# Altium project PCB_Project.PrjPcb
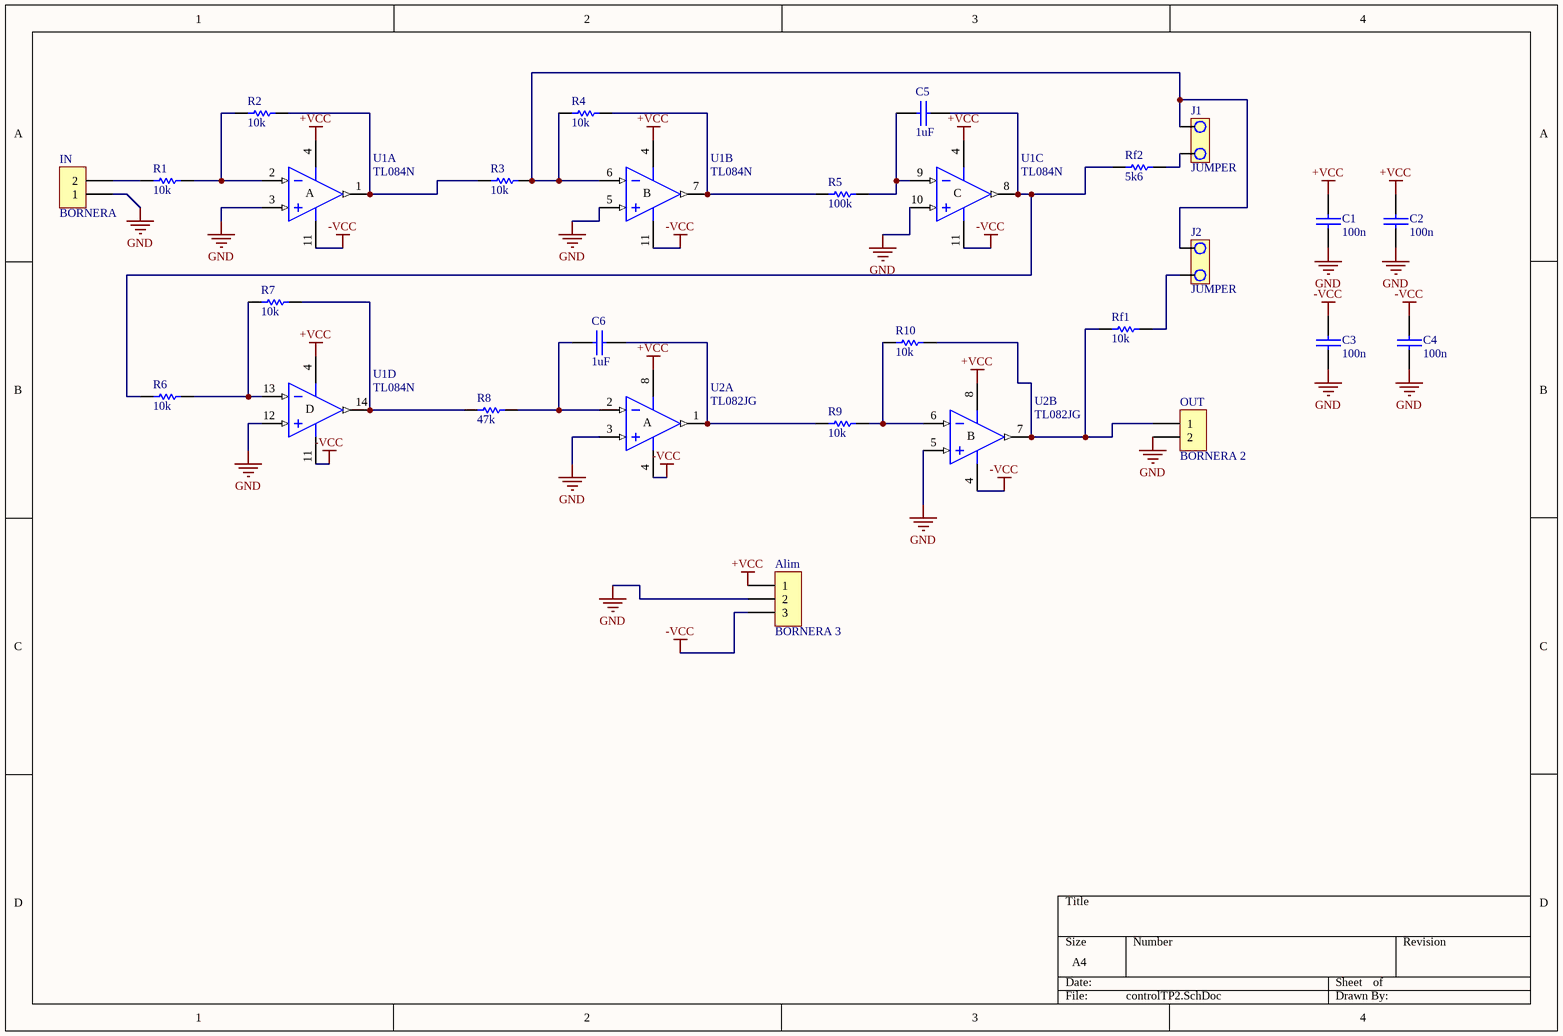
[diagram p0: controlTP2.SchDoc]
1 sheet, 25 parts. Net scope: global (net labels, ports and power ports of the same name join across sheets).
Board file: controlTP2.PcbDoc

## Sheet controlTP2.SchDoc
size A4

### Parts
Alim  BORNERA 3  [BORNERA3]
C1  100n  [CAP200]
C2  100n  [CAP200]
C3  100n  [CAP200]
C4  100n  [CAP200]
C5  1uF  [CAP200]
C6  1uF  [CAP200]
IN  BORNERA  [BORNERA2]
J1  JUMPER  [JUMPER2]
J2  JUMPER  [JUMPER2]
OUT  BORNERA 2  [BORNERA2]
R1  10k  [RES400]
R2  10k  [RES400]
R3  10k  [RES400]
R4  10k  [RES400]
R5  100k  [RES400]
R6  10k  [RES400]
R7  10k  [RES400]
R8  47k  [RES400]
R9  10k  [RES400]
R10  10k  [RES400]
Rf1  10k  [RES400]
Rf2  5k6  [RES400]
U1  TL084N  [N014]  (parts A,B,C,D of 4)
U2  TL082JG  [JG008]  (parts A,B of 2)

### Nets
+VCC: Alim.1 C1.1 C2.1 U1.4(V+) U2.8(V+)
-VCC: Alim.3 C3.1 C4.1 U1.11(V-) U2.4(V-)
GND: Alim.2 C1.2 C2.2 C3.2 C4.2 IN.1 OUT.2 U1.3(IN+) U1.5(IN+) U1.10(IN+) U1.12(IN+) U2.3(IN+) U2.5(IN+)
NetC5_1: C5.1 R5.2 U1.9(IN-)
NetC5_2: C5.2 R6.1 Rf2.2 U1.8(OUT)
NetC6_1: C6.1 R8.2 U2.2(IN-)
NetC6_2: C6.2 R9.1 U2.1(OUT)
NetIN_2: IN.2 R1.1
NetJ1_1: J1.1 Rf2.1
NetJ1_2: J1.2 J2.2 R3.2 R4.1 U1.6(IN-)
NetJ2_1: J2.1 Rf1.1
NetOUT_1: OUT.1 R10.2 Rf1.2 U2.7(OUT)
NetR1_2: R1.2 R2.1 U1.2(IN-)
NetR2_2: R2.2 R3.1 U1.1(OUT)
NetR4_2: R4.2 R5.1 U1.7(OUT)
NetR6_2: R6.2 R7.1 U1.13(IN-)
NetR7_2: R7.2 R8.1 U1.14(OUT)
NetR9_2: R9.2 R10.1 U2.6(IN-)

### Notes on the sheet
- (in symbol TL082JG, part A) A
- (in symbol TL082JG, part B) B
- (in symbol TL084N, part A) A
- (in symbol TL084N, part B) B
- (in symbol TL084N, part C) C
- (in symbol TL084N, part D) D

### Library data of the parts
C1-C6 = CAP
IN = BORNERA 2
R1-R10 Rf1 Rf2 = RES
U1 = TL084N: JFET-Input Operational Amplifier; Published: 16-Jan-2001; LatestRevisionDate: 04-Mar-2005; LatestRevisionNote: Stylized 3D Model Added.; DatasheetVersion: Feb-1999; PackageVersion: Oct-1995; PackageReference: N014; Publisher: Altium Limited; PackageDescription: DIP; 14 Leads; Row Spacing 7.62 mm; Pitch 2.54 mm; ComponentLink1Description: Manufacturer Link; ComponentLink1URL: http://www.ti.com/; ComponentLink2Description: Datasheet; ComponentLink2URL: http://www-s.ti.com/sc/ds/tl084.pdf
U2 = TL082JG: JFET-Input Operational Amplifier; Published: 16-Jan-2001; LatestRevisionDate: 04-Mar-2005; LatestRevisionNote: Stylized 3D Model Added.; DatasheetVersion: Feb-1999; PackageVersion: Jan-1995; PackageReference: JG008; Publisher: Altium Limited; PackageDescription: DIP; 8 Leads; Row Spacing 7.62 mm; Pitch 2.54 mm; ComponentLink1Description: Manufacturer Link; ComponentLink1URL: http://www.ti.com/; ComponentLink2Description: Datasheet; ComponentLink2URL: http://www-s.ti.com/sc/ds/tl082.pdf